# Altium schematic sheet DDR3Modules.SchDoc
size A3; SheetNumber: 16; SheetTotal: 18
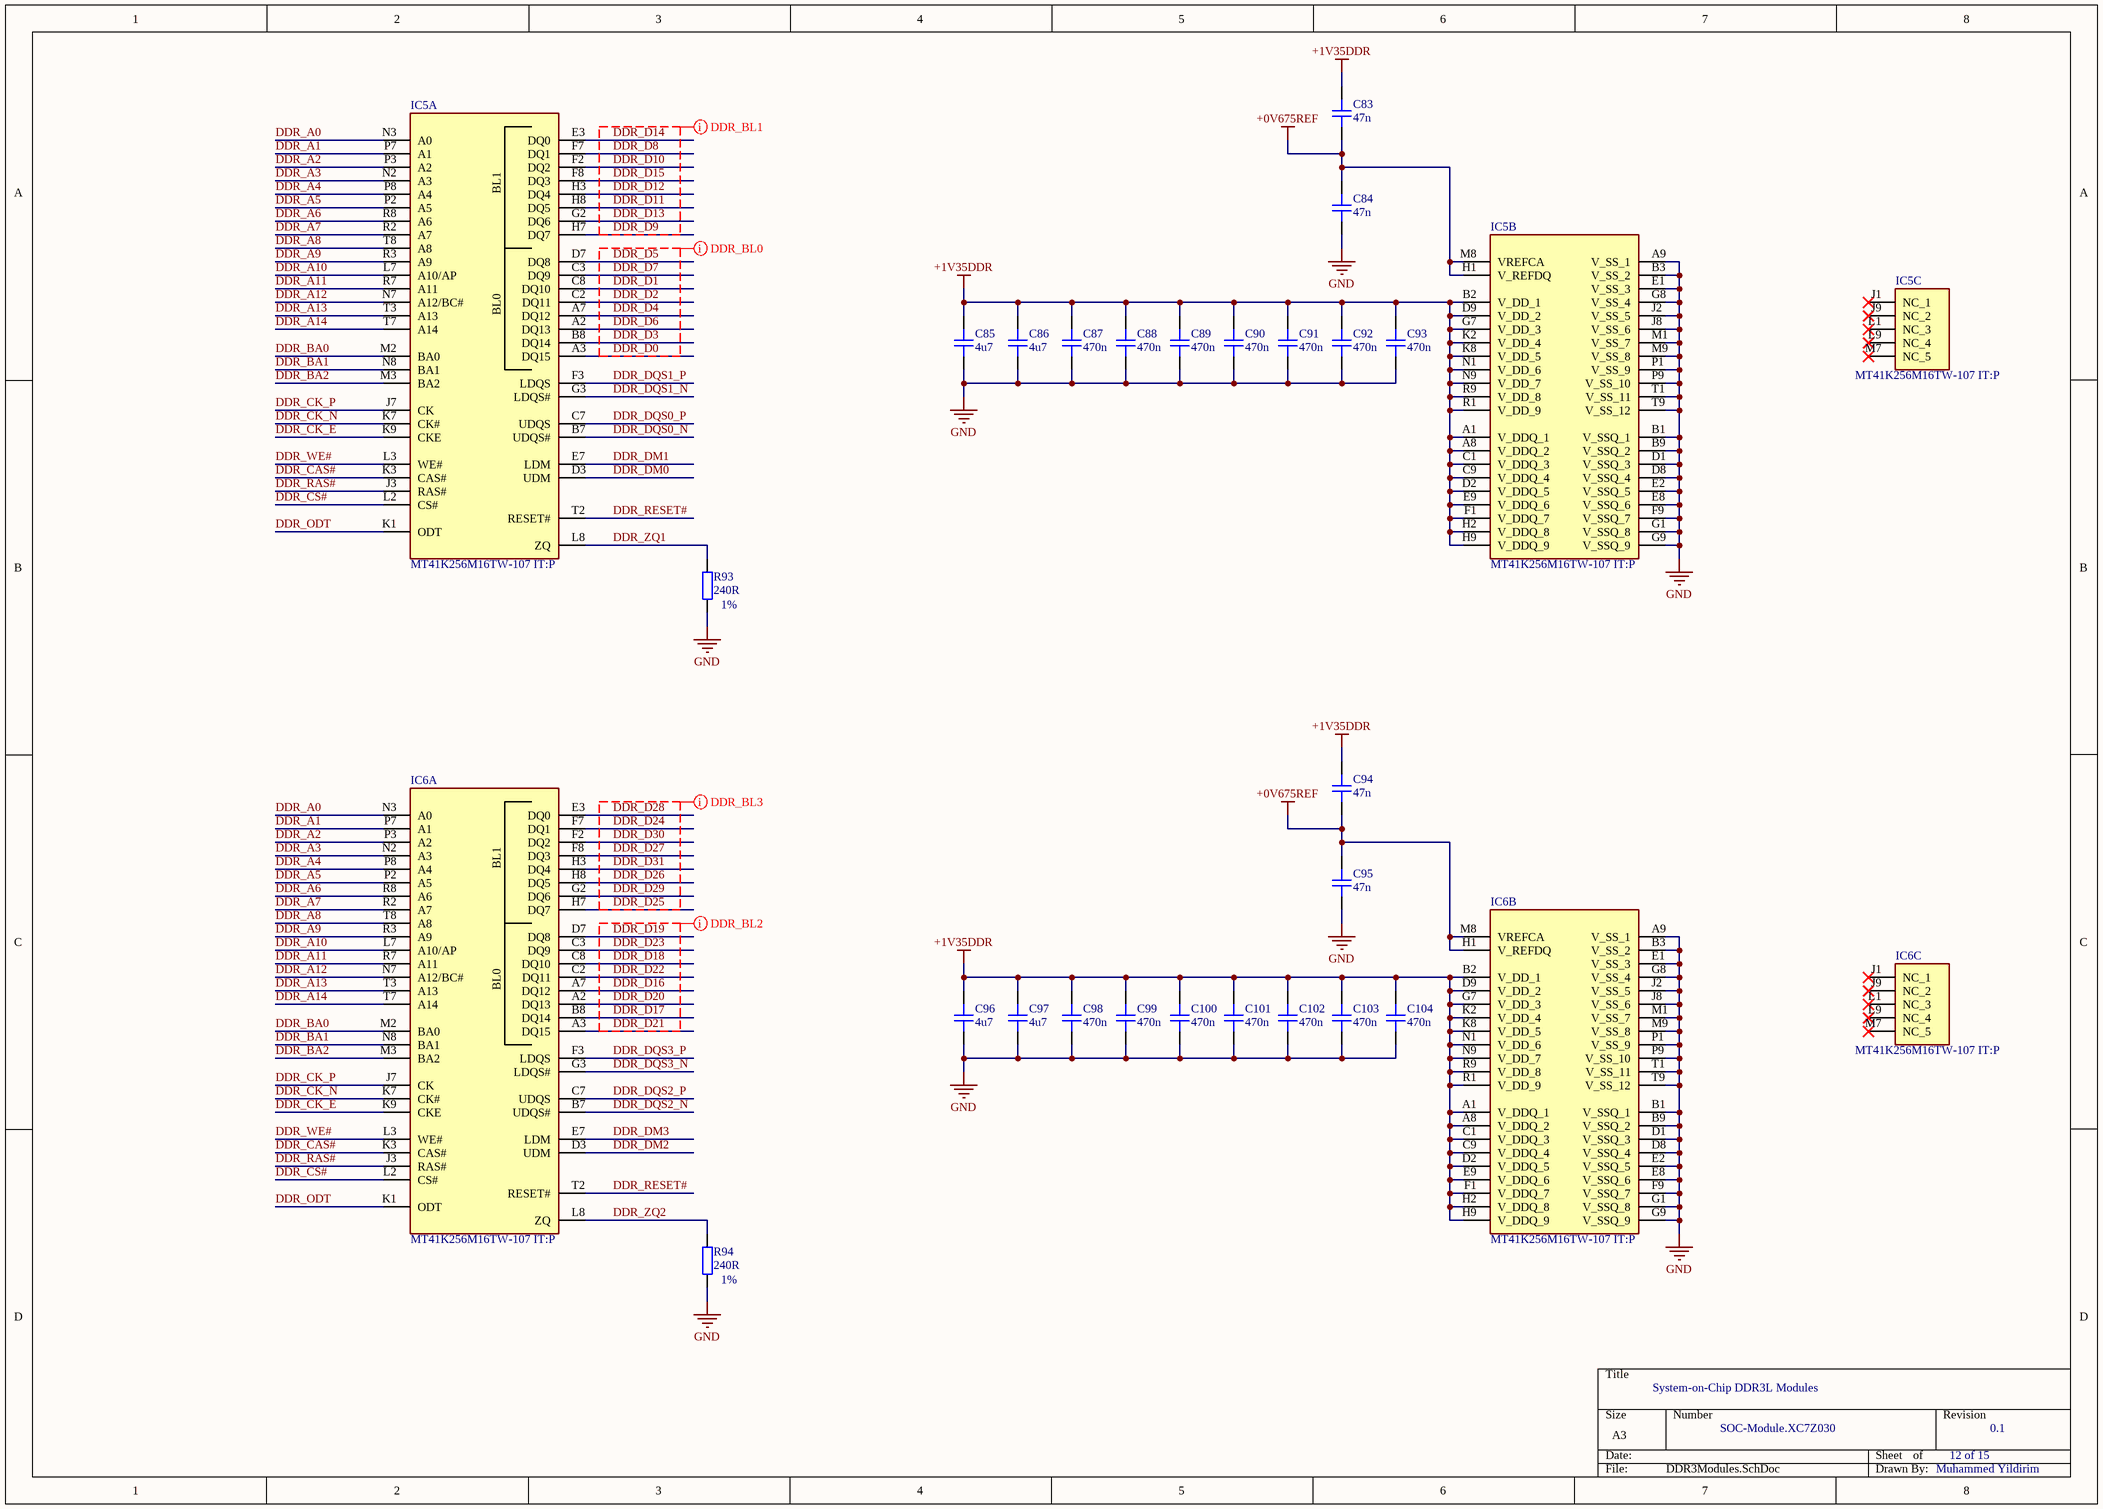
[diagram p0: DDR3Modules.SchDoc]

## Parts
C83  47n  [CAP_0201]
C84  47n  [CAP_0201]
C85  4u7  [CAP_0402]
C86  4u7  [CAP_0402]
C87  470n  [CAP_0201]
C88  470n  [CAP_0201]
C89  470n  [CAP_0201]
C90  470n  [CAP_0201]
C91  470n  [CAP_0201]
C92  470n  [CAP_0201]
C93  470n  [CAP_0201]
C94  47n  [CAP_0201]
C95  47n  [CAP_0201]
C96  4u7  [CAP_0402]
C97  4u7  [CAP_0402]
C98  470n  [CAP_0201]
C99  470n  [CAP_0201]
C100  470n  [CAP_0201]
C101  470n  [CAP_0201]
C102  470n  [CAP_0201]
C103  470n  [CAP_0201]
C104  470n  [CAP_0201]
IC5  MT41K256M16TW-107 IT:P  [BGA96C80P9X16_800X1400X120]  (parts A,B,C of 3)
IC6  MT41K256M16TW-107 IT:P  [BGA96C80P9X16_800X1400X120]  (parts A,B,C of 3)
R93  240R  [RES_0201]
R94  240R  [RES_0201]

## Nets
+0V675REF: C83.1 C84.2 C94.1 C95.2 IC5.H1(V_REFDQ) IC5.M8(VREFCA) IC6.H1(V_REFDQ) IC6.M8(VREFCA)
+1V35DDR: C83.2 C85.2 C86.2 C87.2 C88.2 C89.2 C90.2 C91.2 C92.2 C93.2 C94.2 C96.2 C97.2 C98.2 C99.2 C100.2 C101.2 C102.2 C103.2 C104.2 IC5.A1(V_DDQ_1) IC5.A8(V_DDQ_2) IC5.B2(V_DD_1) IC5.C1(V_DDQ_3) IC5.C9(V_DDQ_4) IC5.D2(V_DDQ_5) IC5.D9(V_DD_2) IC5.E9(V_DDQ_6) IC5.F1(V_DDQ_7) IC5.G7(V_DD_3) IC5.H2(V_DDQ_8) IC5.H9(V_DDQ_9) IC5.K2(V_DD_4) IC5.K8(V_DD_5) IC5.N1(V_DD_6) IC5.N9(V_DD_7) IC5.R1(V_DD_9) IC5.R9(V_DD_8) IC6.A1(V_DDQ_1) IC6.A8(V_DDQ_2) IC6.B2(V_DD_1) IC6.C1(V_DDQ_3) IC6.C9(V_DDQ_4) IC6.D2(V_DDQ_5) IC6.D9(V_DD_2) IC6.E9(V_DDQ_6) IC6.F1(V_DDQ_7) IC6.G7(V_DD_3) IC6.H2(V_DDQ_8) IC6.H9(V_DDQ_9) IC6.K2(V_DD_4) IC6.K8(V_DD_5) IC6.N1(V_DD_6) IC6.N9(V_DD_7) IC6.R1(V_DD_9) IC6.R9(V_DD_8)
GND: C84.1 C85.1 C86.1 C87.1 C88.1 C89.1 C90.1 C91.1 C92.1 C93.1 C95.1 C96.1 C97.1 C98.1 C99.1 C100.1 C101.1 C102.1 C103.1 C104.1 IC5.A9(V_SS_1) IC5.B1(V_SSQ_1) IC5.B3(V_SS_2) IC5.B9(V_SSQ_2) IC5.D1(V_SSQ_3) IC5.D8(V_SSQ_4) IC5.E1(V_SS_3) IC5.E2(V_SSQ_5) IC5.E8(V_SSQ_6) IC5.F9(V_SSQ_7) IC5.G1(V_SSQ_8) IC5.G8(V_SS_4) IC5.G9(V_SSQ_9) IC5.J2(V_SS_5) IC5.J8(V_SS_6) IC5.M1(V_SS_7) IC5.M9(V_SS_8) IC5.P1(V_SS_9) IC5.P9(V_SS_10) IC5.T1(V_SS_11) IC5.T9(V_SS_12) IC6.A9(V_SS_1) IC6.B1(V_SSQ_1) IC6.B3(V_SS_2) IC6.B9(V_SSQ_2) IC6.D1(V_SSQ_3) IC6.D8(V_SSQ_4) IC6.E1(V_SS_3) IC6.E2(V_SSQ_5) IC6.E8(V_SSQ_6) IC6.F9(V_SSQ_7) IC6.G1(V_SSQ_8) IC6.G8(V_SS_4) IC6.G9(V_SSQ_9) IC6.J2(V_SS_5) IC6.J8(V_SS_6) IC6.M1(V_SS_7) IC6.M9(V_SS_8) IC6.P1(V_SS_9) IC6.P9(V_SS_10) IC6.T1(V_SS_11) IC6.T9(V_SS_12) R93.1 R94.1
DDR_A0: IC5.N3(A0) IC6.N3(A0)
DDR_A1: IC5.P7(A1) IC6.P7(A1)
DDR_A2: IC5.P3(A2) IC6.P3(A2)
DDR_A3: IC5.N2(A3) IC6.N2(A3)
DDR_A4: IC5.P8(A4) IC6.P8(A4)
DDR_A5: IC5.P2(A5) IC6.P2(A5)
DDR_A6: IC5.R8(A6) IC6.R8(A6)
DDR_A7: IC5.R2(A7) IC6.R2(A7)
DDR_A8: IC5.T8(A8) IC6.T8(A8)
DDR_A9: IC5.R3(A9) IC6.R3(A9)
DDR_A10: IC5.L7(A10/AP) IC6.L7(A10/AP)
DDR_A11: IC5.R7(A11) IC6.R7(A11)
DDR_A12: IC5.N7(A12/BC#) IC6.N7(A12/BC#)
DDR_A13: IC5.T3(A13) IC6.T3(A13)
DDR_A14: IC5.T7(A14) IC6.T7(A14)
DDR_BA0: IC5.M2(BA0) IC6.M2(BA0)
DDR_BA1: IC5.N8(BA1) IC6.N8(BA1)
DDR_BA2: IC5.M3(BA2) IC6.M3(BA2)
DDR_CAS#: IC5.K3(CAS#) IC6.K3(CAS#)
DDR_CK_E: IC5.K9(CKE) IC6.K9(CKE)
DDR_CK_N: IC5.K7(CK#) IC6.K7(CK#)
DDR_CK_P: IC5.J7(CK) IC6.J7(CK)
DDR_CS#: IC5.L2(CS#) IC6.L2(CS#)
DDR_D0: IC5.A3(DQ15)
DDR_D1: IC5.C8(DQ10)
DDR_D2: IC5.C2(DQ11)
DDR_D3: IC5.B8(DQ14)
DDR_D4: IC5.A7(DQ12)
DDR_D5: IC5.D7(DQ8)
DDR_D6: IC5.A2(DQ13)
DDR_D7: IC5.C3(DQ9)
DDR_D8: IC5.F7(DQ1)
DDR_D9: IC5.H7(DQ7)
DDR_D10: IC5.F2(DQ2)
DDR_D11: IC5.H8(DQ5)
DDR_D12: IC5.H3(DQ4)
DDR_D13: IC5.G2(DQ6)
DDR_D14: IC5.E3(DQ0)
DDR_D15: IC5.F8(DQ3)
DDR_D16: IC6.A7(DQ12)
DDR_D17: IC6.B8(DQ14)
DDR_D18: IC6.C8(DQ10)
DDR_D19: IC6.D7(DQ8)
DDR_D20: IC6.A2(DQ13)
DDR_D21: IC6.A3(DQ15)
DDR_D22: IC6.C2(DQ11)
DDR_D23: IC6.C3(DQ9)
DDR_D24: IC6.F7(DQ1)
DDR_D25: IC6.H7(DQ7)
DDR_D26: IC6.H8(DQ5)
DDR_D27: IC6.F8(DQ3)
DDR_D28: IC6.E3(DQ0)
DDR_D29: IC6.G2(DQ6)
DDR_D30: IC6.F2(DQ2)
DDR_D31: IC6.H3(DQ4)
DDR_DM0: IC5.D3(UDM)
DDR_DM1: IC5.E7(LDM)
DDR_DM2: IC6.D3(UDM)
DDR_DM3: IC6.E7(LDM)
DDR_DQS0_N: IC5.B7(UDQS#)
DDR_DQS0_P: IC5.C7(UDQS)
DDR_DQS1_N: IC5.G3(LDQS#)
DDR_DQS1_P: IC5.F3(LDQS)
DDR_DQS2_N: IC6.B7(UDQS#)
DDR_DQS2_P: IC6.C7(UDQS)
DDR_DQS3_N: IC6.G3(LDQS#)
DDR_DQS3_P: IC6.F3(LDQS)
DDR_ODT: IC5.K1(ODT) IC6.K1(ODT)
DDR_RAS#: IC5.J3(RAS#) IC6.J3(RAS#)
DDR_RESET#: IC5.T2(RESET#) IC6.T2(RESET#)
DDR_WE#: IC5.L3(WE#) IC6.L3(WE#)
DDR_ZQ1: IC5.L8(ZQ) R93.2
DDR_ZQ2: IC6.L8(ZQ) R94.2

Not connected (* = marked no-connect by the designer): IC5 J1(NC_1)* J9(NC_2)* L1(NC_3)* L9(NC_4)* M7(NC_5)*; IC6 J1(NC_1)* J9(NC_2)* L1(NC_3)* L9(NC_4)* M7(NC_5)*

## Layout directives
mark named DDR_BL1: DDR_D8, DDR_D9, DDR_D10, DDR_D11, DDR_D12, DDR_D13, DDR_D14, DDR_D15
mark named DDR_BL0: DDR_D0, DDR_D1, DDR_D2, DDR_D3, DDR_D4, DDR_D5, DDR_D6, DDR_D7
mark named DDR_BL2: DDR_D16, DDR_D17, DDR_D18, DDR_D19, DDR_D20, DDR_D21, DDR_D22, DDR_D23
mark named DDR_BL3: DDR_D24, DDR_D25, DDR_D26, DDR_D27, DDR_D28, DDR_D29, DDR_D30, DDR_D31

## Notes on the sheet
- (near R93) 1%
- (near R94) 1%
- System-on-Chip DDR3L Modules
- SOC-Module.XC7Z030
- 12 of 15
- 0.1
- Muhammed Yildirim
- (in symbol MT41K256M16TW-107 IT:P, part A) BL1; BL0

## Library data of the parts
C83 C84 C87-C95 C98-C104 = CAP_0201: Capacitor SMD 0201; Manufacturer: *; Manufacturer Part Number: *; Distributor Link: *; LCSC: *; Rating: *; Dielectric: *
C85 C86 C96 C97 = CAP_0402: Capacitor SMD 0402; Manufacturer: *; Manufacturer Part Number: *; Distributor Link: *; LCSC: *; Rating: *; Dielectric: *
IC5 IC6 = MT41K256M16TW-107 IT:P: Integrated Circuit; Manufacturer_Name: Micron; Datasheet Link: https://datasheet.octopart.com/MT41K256M16TW-107-IT%3AP-Micron-datasheet-134530703.pdf; Height: 1.2mm; Manufacturer_Part_Number: MT41K256M16TW-107 IT:P; Mouser Part Number: 340-265862-TRAY; Mouser Price/Stock: https://www.mouser.co.uk/ProductDetail/Micron/MT41K256M16TW-107-ITP?qs=rrS6PyfT74dVaU4J%2FCiQdg%3D%3D; Arrow Part Number: MT41K256M16TW-107 IT:P; Arrow Price/Stock: https://www.arrow.com/en/products/mt41k256m16tw-107-itp/micron-technology?region=europe
R93 R94 = RES_0201: Resistor SMD 0201; Manufacturer: *; Manufacturer Part Number: *; Distributor Link: *; LCSC: *